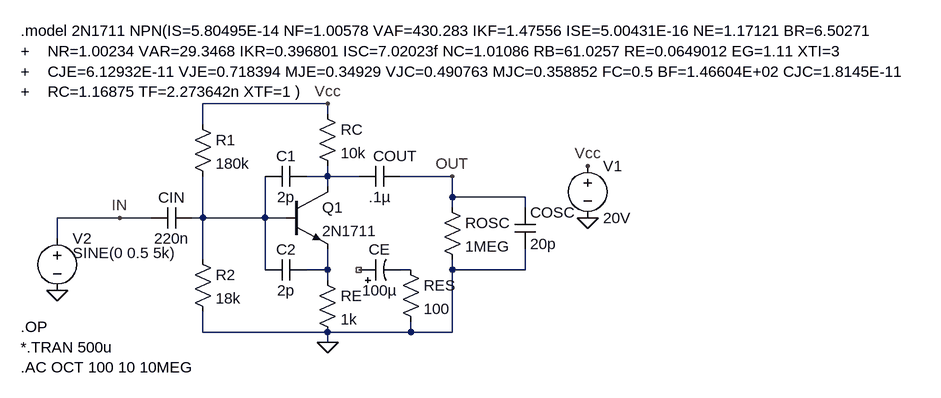
[diagram p0: schematic BJT Ampli CE.asc]
BJT Ampli CE.asc, the LTspice schematic file:
Version 4
SHEET 1 3936 680
WIRE 32 32 -160 32
WIRE 32 48 32 32
WIRE -160 64 -160 32
WIRE 32 144 32 128
WIRE 32 144 0 144
WIRE 80 144 32 144
WIRE 224 144 144 144
WIRE 32 160 32 144
WIRE 224 176 224 144
WIRE 336 176 224 176
WIRE 224 192 224 176
WIRE 336 192 336 176
WIRE -288 208 -384 208
WIRE -240 208 -288 208
WIRE -160 208 -160 144
WIRE -160 208 -176 208
WIRE -64 208 -64 144
WIRE -64 208 -160 208
WIRE -32 208 -64 208
WIRE -384 240 -384 208
WIRE -160 272 -160 208
WIRE -64 288 -64 208
WIRE 32 288 32 256
WIRE 32 288 0 288
WIRE 160 288 144 288
WIRE 224 288 224 272
WIRE 336 288 336 256
WIRE 336 288 224 288
WIRE 32 304 32 288
WIRE -160 384 -160 352
WIRE 32 384 -160 384
WIRE 160 384 160 368
WIRE 160 384 32 384
WIRE 224 384 224 288
WIRE 224 384 160 384
WIRE 32 400 32 384
FLAG 32 400 0
FLAG 432 208 0
FLAG 432 128 Vcc
FLAG 32 32 Vcc
FLAG -384 320 0
FLAG 224 144 OUT
FLAG -288 208 IN
SYMBOL npn -32 160 R0
SYMATTR InstName Q1
SYMATTR Value 2N1711
SYMBOL res -176 48 R0
SYMATTR InstName R1
SYMATTR Value 180k
SYMBOL res 16 288 R0
SYMATTR InstName RE
SYMATTR Value 1k
SYMBOL res -176 256 R0
SYMATTR InstName R2
SYMATTR Value 18k
SYMBOL cap -176 192 R90
WINDOW 0 0 32 VBottom 2
WINDOW 3 32 32 VTop 2
SYMATTR InstName CIN
SYMATTR Value 220n
SYMBOL cap 144 128 R90
WINDOW 0 0 8 VBottom 2
WINDOW 3 32 32 VTop 2
SYMATTR InstName COUT
SYMATTR Value .1µ
SYMBOL res 16 32 R0
SYMATTR InstName RC
SYMATTR Value 10k
SYMBOL voltage 432 112 R0
SYMATTR InstName V1
SYMATTR Value 20V
SYMBOL voltage -384 224 R0
WINDOW 3 24 38 Left 2
SYMATTR Value SINE(0 0.5 5k)
SYMATTR InstName V2
SYMATTR Value2 AC 1
SYMBOL res 208 176 R0
SYMATTR InstName ROSC
SYMATTR Value 1MEG
SYMBOL polcap 80 304 R270
WINDOW 0 32 32 VTop 2
WINDOW 3 0 32 VBottom 2
SYMATTR InstName CE
SYMATTR Value 100µ
SYMBOL res 144 272 R0
SYMATTR InstName RES
SYMATTR Value 100
SYMBOL cap 0 128 R90
WINDOW 0 0 32 VBottom 2
WINDOW 3 32 32 VTop 2
SYMATTR InstName C1
SYMATTR Value 2p
SYMBOL cap 0 272 R90
WINDOW 0 0 32 VBottom 2
WINDOW 3 32 32 VTop 2
SYMATTR InstName C2
SYMATTR Value 2p
SYMBOL cap 320 192 R0
SYMATTR InstName COSC
SYMATTR Value 20p
TEXT -440 376 Left 2 !.OP\n*.TRAN 500u\n.AC OCT 100 10 10MEG
TEXT -440 -80 Left 2 !.model 2N1711 NPN(IS=5.80495E-14 NF=1.00578 VAF=430.283 IKF=1.47556 ISE=5.00431E-16 NE=1.17121 BR=6.50271 \n+	NR=1.00234 VAR=29.3468 IKR=0.396801 ISC=7.02023f NC=1.01086 RB=61.0257 RE=0.0649012 EG=1.11 XTI=3 \n+	CJE=6.12932E-11 VJE=0.718394 MJE=0.34929 VJC=0.490763 MJC=0.358852 FC=0.5 BF=1.46604E+02 CJC=1.8145E-11 \n+	RC=1.16875 TF=2.273642n XTF=1 )

The netlist it stands for:
* BJT Ampli CE.asc
Q1 N001 N002 N003 0 2N1711
R1 Vcc N002 180k
RE N003 0 1k
R2 N002 0 18k
CIN N002 IN 220n
COUT OUT N001 .1µ
RC Vcc N001 10k
V1 Vcc 0 20V
V2 IN 0 SINE(0 0.5 5k) AC 1
ROSC OUT 0 1MEG
CE NC_01 N004 100µ
RES N004 0 100
C1 N001 N002 2p
C2 N003 N002 2p
COSC OUT 0 20p
.model NPN NPN
.model PNP PNP
.lib standard.bjt
.OP
*.TRAN 500u
.AC OCT 100 10 10MEG
.model 2N1711 NPN(IS=5.80495E-14 NF=1.00578 VAF=430.283 IKF=1.47556 ISE=5.00431E-16 NE=1.17121 BR=6.50271
+	NR=1.00234 VAR=29.3468 IKR=0.396801 ISC=7.02023f NC=1.01086 RB=61.0257 RE=0.0649012 EG=1.11 XTI=3
+	CJE=6.12932E-11 VJE=0.718394 MJE=0.34929 VJC=0.490763 MJC=0.358852 FC=0.5 BF=1.46604E+02 CJC=1.8145E-11
+	RC=1.16875 TF=2.273642n XTF=1 )
.backanno
.end